# Altium schematic sheet PLD_ADC_MUX.SchDoc: RadFET
size A4; SheetTotal: 32
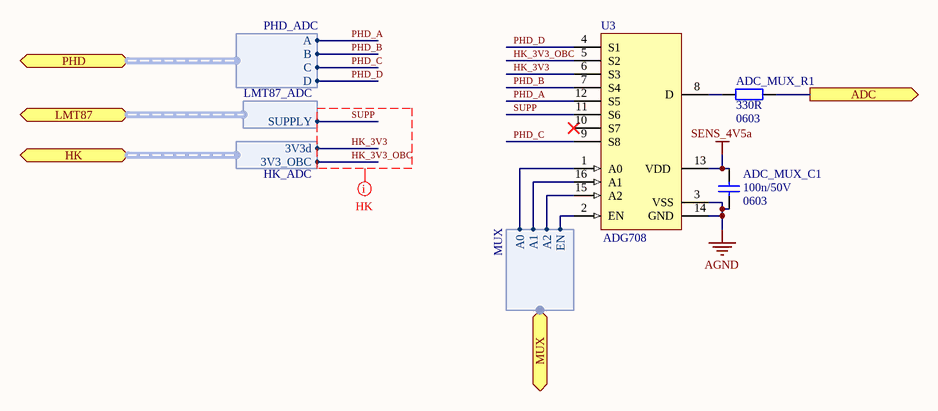
[diagram p0: PLD_ADC_MUX.SchDoc]

## Parts
ADC_MUX_C1  Package: 0603  [SMD_Capacitor_0603]  (hidden comment: 100n/50V)
ADC_MUX_R1  Package: 0603  [SMD_Resistor_0603]  (hidden comment: 330R)
U3  ADG708  [TSSOP16]

## Ports
ADC (out), HK (harness HK_ADC), LMT87 (harness LMT87_ADC), MUX (harness MUX), PHD (harness PHD_ADC)

## Harnesses
MUX: A0, A1, A2, EN
HK_ADC: 3V3_OBC, 3V3d
LMT87_ADC: SUPPLY
PHD_ADC: A, B, C, D

## Nets
AGND: ADC_MUX_C1.2 U3.3(VSS) U3.14(GND)
SENS_4V5a: ADC_MUX_C1.1 U3.13(VDD)
ADC: ADC_MUX_R1.2 ; port ADC
HK_3V3: U3.6(S3) ; port HK.3V3d
HK_3V3_OBC: U3.5(S2) ; port HK.3V3_OBC
PHD_A: U3.12(S5) ; port PHD.A
PHD_B: U3.7(S4) ; port PHD.B
PHD_C: U3.9(S8) ; port PHD.C
PHD_D: U3.4(S1) ; port PHD.D
SUPP: U3.11(S6) ; port LMT87.SUPPLY
NetADC_MUX_R1_1: ADC_MUX_R1.1 U3.8(D)
NetU3_1: U3.1(A0) ; port MUX.A0
NetU3_2: U3.2(EN) ; port MUX.EN
NetU3_15: U3.15(A2) ; port MUX.A2
NetU3_16: U3.16(A1) ; port MUX.A1

Not connected (* = marked no-connect by the designer): U3 10(S7)*

## Layout directives
net class HK: HK_3V3, HK_3V3_OBC, SUPP

## Notes on the sheet
- Title:
- Project:
- Author:
- Model:
- Document Number:
- Checked by:
- Rev:
- Date:
- Approved by:
- Sheet:
- of
- File name:

## Library data of the parts
ADC_MUX_C1 = Cer_C0603T104K5RALTU: Ceramic Cap Kemet COTS 100n/50V X7R 0603; Manufacturer: Kemet; ManufacturerPartNumber: C0603T104K5RALTU; Value: 100n/50V
ADC_MUX_R1 = Res: Value: 330R
U3 = ADG708: CMOS Analog 8:1 Multiplexer; Manufacturer: Analog Devices; ManufacturerPartNumber: ADG708